# EAGLE schematic 24V_RAIL (EAGLE 7.4.0)
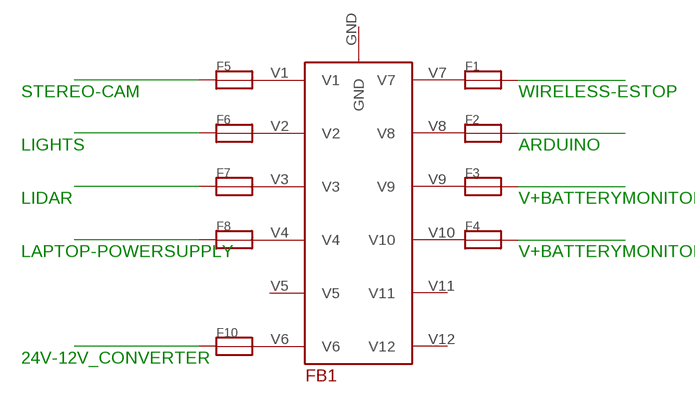
[diagram p0: schematic, sheet 1]

## Parts
F1  FUSE  [FUSE]
F2  FUSE  [FUSE]
F3  FUSE  [FUSE]
F4  FUSE  [FUSE]
F5  FUSE  [FUSE]
F6  FUSE  [FUSE]
F7  FUSE  [FUSE]
F8  FUSE  [FUSE]
F10  FUSE  [FUSE]
FB1  FUSEBLOCK-12  [FUSEBLOCK-12PT]

## Nets
LAPTOP-PS: F8.P$1
LIDAR: F7.P$1
LIGHTS: F6.P$1
N$1: F5.P$2 FB1.V1
N$2: F6.P$2 FB1.V2
N$3: F7.P$2 FB1.V3
N$4: F8.P$2 FB1.V4
N$5: F1.P$1 FB1.V7
N$6: F2.P$1 FB1.V8
N$7: F3.P$1 FB1.V9
N$8: F4.P$1 FB1.V10
N$9: F1.P$2
N$10: F10.P$2 FB1.V6
N$11: F2.P$2
N$12: F3.P$2
N$13: F4.P$2
N$18: F10.P$1
STEREO-CAM: F5.P$1

## Notes on the sheet
- STEREO-CAM | WIRELESS-ESTOP
- LIGHTS | ARDUINO
- LIDAR | V+BATTERYMONITOR
- LAPTOP-POWERSUPPLY | V+BATTERYMONITOR
- 24V-12V_CONVERTER

## Power pins joined to a net without a drawn wire
GND: FB1.GND
V5: FB1.V5
V11: FB1.V11
V12: FB1.V12

## Library data of the parts
F1-F8 F10 = igvc:FUSE
FB1 = igvc:FUSEBLOCK-12